# EAGLE design jnode (EAGLE 6.0)
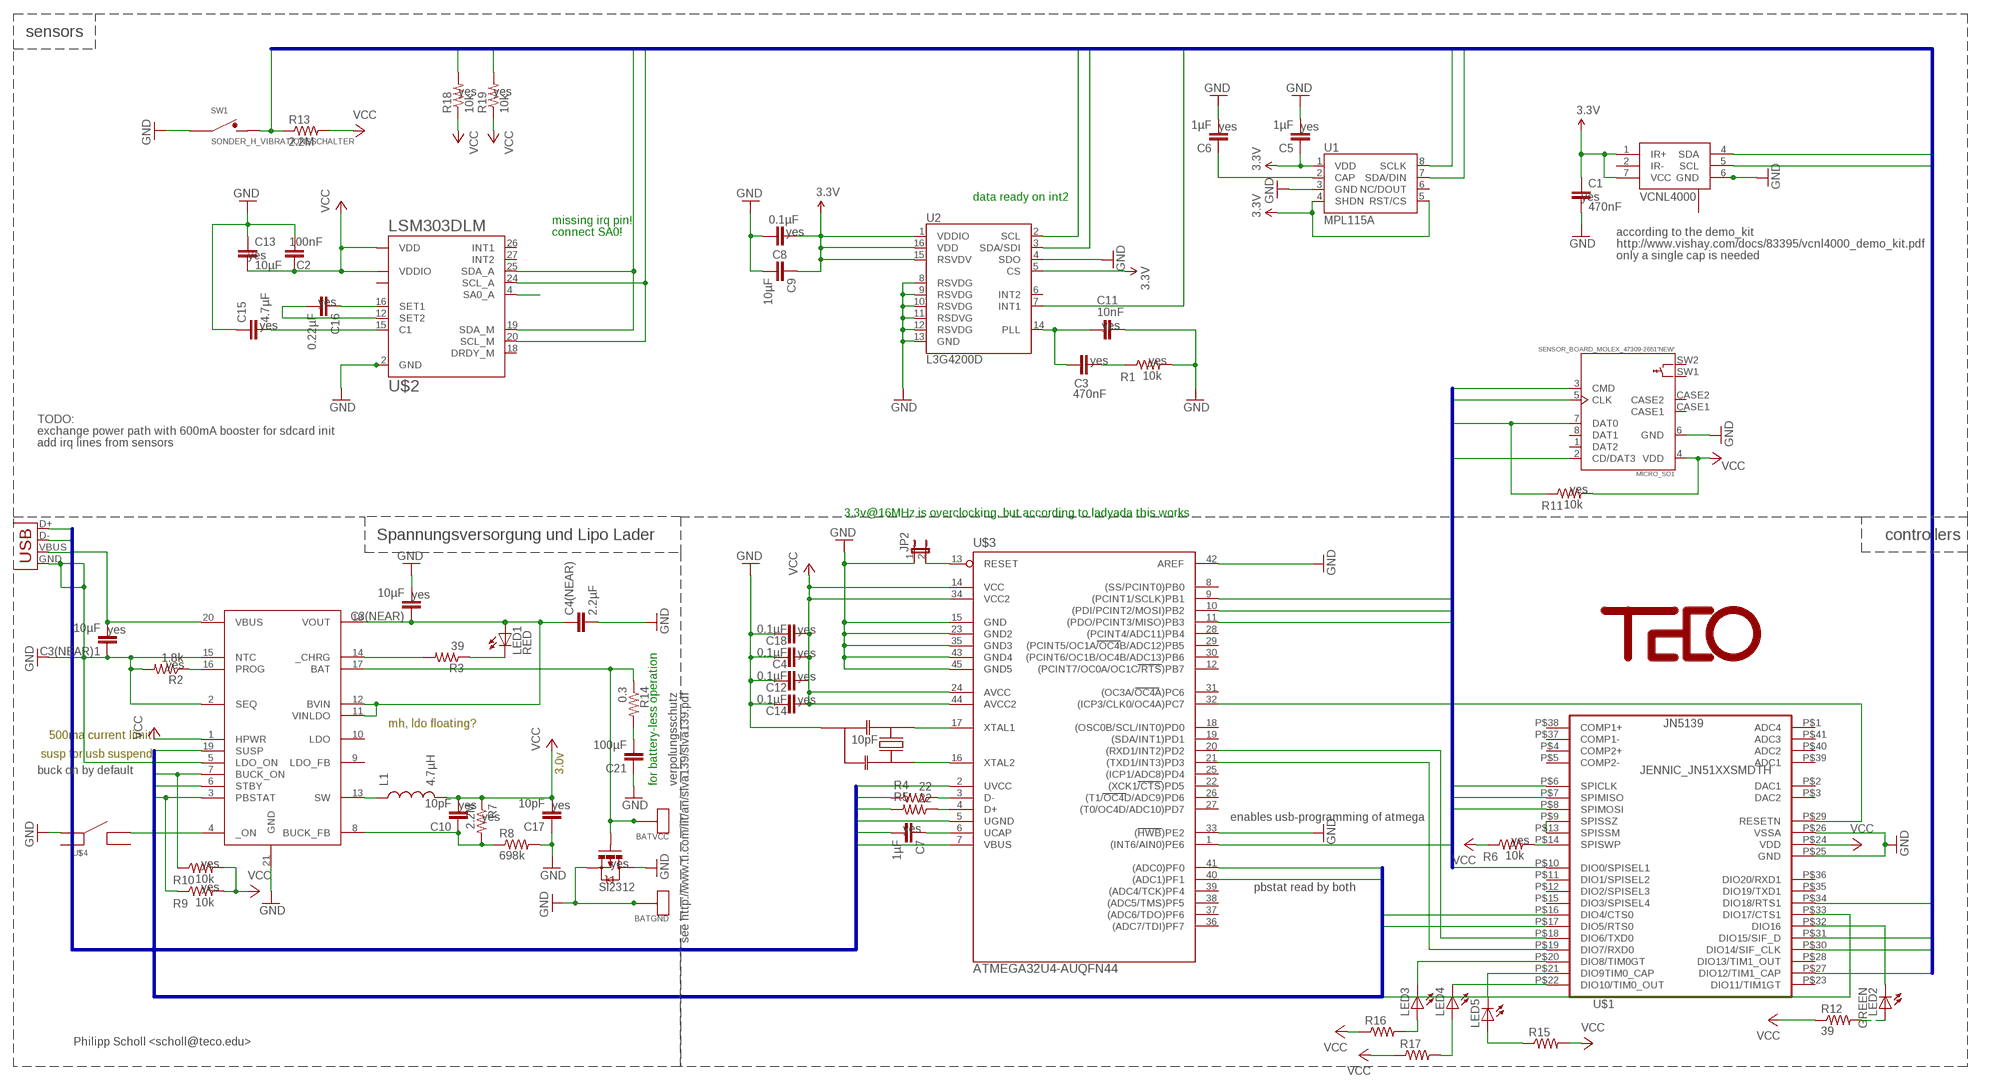
[diagram p0: schematic, sheet 1]

## Parts
BATGND  BATPAD  BATPADBATPAD  [BATPAD]
BATVCC  BATPAD  BATPADBATPAD  [BATPAD]
C1  470nF  CAP0402-CAP  [0402-CAP]
C2  100nF  CAP0402-CAP  [0402-CAP]
C3  470nF  CAP0402-CAP  [0402-CAP]
C3(NEAR)  10µF  CAP0603-CAP  [0603-CAP]
C3(NEAR)1  10µF  CAP0603-CAP  [0603-CAP]
C4  0.1µF  CAP0402-CAP  [0402-CAP]
C4(NEAR)  2.2µF  CAP0402-CAP  [0402-CAP]
C5  1µF  CAP0402-CAP  [0402-CAP]
C6  1µF  CAP0402-CAP  [0402-CAP]
C7  1µF  CAP0402-CAP  [0402-CAP]
C8  0.1µF  CAP0402-CAP  [0402-CAP]
C9  10µF  CAP0603-CAP  [0603-CAP]
C10  10pF  CAP0402-CAP  [0402-CAP]
C11  10nF  CAP0402-CAP  [0402-CAP]
C12  0.1µF  CAP0402-CAP  [0402-CAP]
C13  10µF  CAP0603-CAP  [0603-CAP]
C14  0.1µF  CAP0402-CAP  [0402-CAP]
C15  4.7µF  CAP0402-CAP  [0402-CAP]
C16  0.22µF  CAP0402-CAP  [0402-CAP]
C17  10pF  CAP0402-CAP  [0402-CAP]
C18  0.1µF  CAP0402-CAP  [0402-CAP]
C21  100µF  CAP0402-CAP  [0402-CAP]
JP2  JUMPER-2SMD-NO  [SJ_2S-NO]
L1  4.7µH  SPARKFUN_INDUCTOR  [MLP2012]
LED1  RED  LEDCHIP-LED0402  [CHIP-LED0402]
LED2  GREEN  LEDCHIP-LED0402  [CHIP-LED0402]
LED3  LEDGL100MD1MP1  [GL100MD1MP1]
LED4  LEDGL100MD1MP1  [GL100MD1MP1]
LED5  LEDGL100MD1MP1  [GL100MD1MP1]
MICRO_SD1  SENSOR_BOARD_MOLEX_47309-2651'NEW'  [SENSOR_BOARD_MOLEX_47309-2651]
R1  10k  RESISTOR0402-RES  [0402-RES]
R2  1.8k  RESISTOR0402-RES  [0402-RES]
R3  39  RESISTOR0402-RES  [0402-RES]
R4  22  RESISTOR0402-RES  [0402-RES]
R5  22  RESISTOR0402-RES  [0402-RES]
R6  10k  RESISTOR0402-RES  [0402-RES]
R7  2.2M  RESISTOR0402-RES  [0402-RES]
R8  698k  RESISTOR0402-RES  [0402-RES]
R9  10k  RESISTOR0402-RES  [0402-RES]
R10  10k  RESISTOR0402-RES  [0402-RES]
R11  10k  RESISTOR0402-RES  [0402-RES]
R12  39  RESISTOR0402-RES  [0402-RES]
R13  2.2M  RESISTOR0805-RES  [0805]
R14  0.3  RESISTOR0402-RES  [0402-RES]
R15  RESISTOR0402-RES  [0402-RES]
R16  RESISTOR0402-RES  [0402-RES]
R17  RESISTOR0402-RES  [0402-RES]
R18  10k  RESISTOR0402-RES  [0402-RES]
R19  10k  RESISTOR0402-RES  [0402-RES]
SI2312  MOSFET-PCHANNELSMD  [SOT23-3]
SW1  SONDER_H_VIBRATIONSSCHALTER  [SONDER_H_VIBSCHALTER]
U1  MPL115A  [LGA8]
U2  L3G4200D  [LGA16-4X4]
U$1  JENNIC_JN51XXSMDTH  [JN5148_SMDTH]
U$2  LSM303DLM  LSM303LGA28_LONG  [LGA28]
U$3  ATMEGA32U4-AUQFN44  [QFN44]
U$4  TACTILE_SWITCH  [EVQ-PUK02K]
U$5  LTC3553  [QFN20]
U$6  RESONATORPRQC-S  [PRQC]
U$9  TECO-LOGO  [TECO-LOGO]
VCNL4000  VCNL4000  [VNCL4000]
X1  USB-MICROB  [USB-MICROB]

## Nets
BUCK_ON: R10.1 U$1.P$16(DIO4/CTS0) U$5.7(BUCK_ON)
CLK: MICRO_SD1.5(CLK) U$1.P$6(SPICLK) U$3.9((PCINT1/SCLK)PB1)
D+: R5.2 X1.D+
D-: R4.2 X1.D-
GND: BATGND.1 BATGND.2(PIN) C1.2 C2.2 C3(NEAR)1.1 C3(NEAR).2 C4(NEAR).2 C4.1 C5.2 C6.2 C7.2 C8.1 C9.2 C11.1 C12.1 C13.1 C14.1 C15.1 C17.1 C18.1 C21.1 JP2.1 MICRO_SD1.6(GND) R1.2 R2.2 R8.2 SI2312.2(S) SI2312.3(D) SW1.1 U1.3(GND) U2.4(SDO) U2.8(RSVDG) U2.9(RSVDG) U2.10(RSVDG) U2.11(RSDVG) U2.12(RSVDG) U2.13(GND) U$1.P$25(GND) U$1.P$26(VSSA) U$2.1(GND) U$2.2(GND) U$2.8(GND) U$2.10(GND) U$2.28(GND) U$3.5(UGND) U$3.15(GND) U$3.23(GND2) U$3.33((HWB)PE2) U$3.35(GND3) U$3.42(AREF) U$3.43(GND4) U$3.45(GND5) U$4.1(A) U$5.2(SEQ) U$5.5(LDO_ON) U$5.15(NTC) U$5.21(GND) U$6.GND VCNL4000.6(GND) VCNL4000.12(GND) X1.GND
INT1: U2.7(INT1) U$1.P$34(DIO18/RTS1)
LEDRED: LED2.P$2(C) U$1.P$32(DIO16)
MISO: MICRO_SD1.7(DAT0) R11.1 U$1.P$7(SPIMISO) U$3.11((PDO/PCINT3/MISO)PB3)
MOSI: MICRO_SD1.3(CMD) U$1.P$8(SPIMOSI) U$3.10((PDI/PCINT2/MOSI)PB2)
N$1: R4.1 U$3.3(D-)
N$2: C16.1 U$2.16(SET1)
N$3: R5.1 U$3.4(D+)
N$4: C7.1 U$3.6(UCAP)
N$5: R2.1 U$5.16(PROG)
N$6: VCNL4000.2(IR-) VCNL4000.3(IR-)
N$8: C16.2 U$2.12(SET2)
N$9: U$4.4(B) U$5.4(_ON)
N$10: C6.1 U1.2(CAP)
N$11: LED1.P$2(C) R3.1
N$12: R3.2 U$5.14(_CHRG)
N$13: U$1.P$9(SPISSZ) U$1.P$13(SPISSM)
N$14: R6.2 U$1.P$14(SPISWP)
N$15: C3(NEAR).1 C4(NEAR).1 LED1.P$1(A) U$5.11(VINLDO) U$5.12(BVIN) U$5.18(VOUT)
N$16: U$3.17(XTAL1) U$6.2
N$17: U$3.16(XTAL2) U$6.1
N$18: L1.P$1 U$5.13(SW)
N$20: C10.1 R7.2 R8.1 U$5.8(BUCK_FB)
N$21: C21.2 R14.2
N$22: U$1.P$18(DIO6/TXD0) U$3.20((RXD1/INT2)PD2)
N$23: U$1.P$19(DIO7/RXD0) U$3.21((TXD1/INT3)PD3)
N$24: U$1.P$29(RESETN) U$3.32((ICP3/CLK0/OC4A)PC7)
N$25: C15.2 U$2.15(C1)
N$26: C3.1 C11.2 U2.14(PLL)
N$27: C3.2 R1.1
N$28: U$2.4(SA0_A)
N$29: LED2.P$1(A) R12.2
N$30: LED5.2(C) U$1.P$21(DIO9TIM0_CAP)
N$31: LED3.2(C) U$1.P$20(DIO8/TIM0GT)
N$32: LED3.1(A) R16.2
N$33: LED5.1(A) R15.1
N$34: LED4.2(C) U$1.P$22(DIO10/TIM0_OUT)
N$35: LED4.1(A) R17.2
PBSTAT: R9.1 U$1.P$33(DIO17/CTS1) U$3.40((ADC1)PF1) U$5.3(PBSTAT)
RES: JP2.2 U$3.13(RESET)
SCLK: R19.2 U1.8(SCLK) U2.2(SCL) U$1.P$30(DIO14/SIF_CLK) U$2.20(SCL_M) U$2.24(SCL_A) VCNL4000.5(SCL)
SDAT: R18.2 U1.7(SDA/DIN) U2.3(SDA/SDI) U$1.P$31(DIO15/SIF_D) U$2.19(SDA_M) U$2.25(SDA_A) VCNL4000.4(SDA)
SSEL: MICRO_SD1.2(CD/DAT3) U$1.P$10(DIO0/SPISEL1) U$3.1((INT6/AIN0)PE6)
STBY: U$1.P$17(DIO5/RTS0) U$5.6(STBY)
SUSP: U$3.41((ADC0)PF0) U$5.19(SUSP)
TCAP: R13.1 SW1.2 U$1.P$27(DIO12/TIM1_CAP)
VBATT: BATVCC.1 BATVCC.2(PIN) R14.1 SI2312.1(G) U$5.17(BAT)
VBUS: C3(NEAR)1.2 U$3.2(UVCC) U$3.7(VBUS) U$5.20(VBUS) X1.VBUS
VCC: C1.1 C2.1 C4.2 C5.1 C8.2 C9.1 C10.2 C12.2 C13.2 C14.2 C17.2 C18.2 L1.P$2 MICRO_SD1.4(VDD) R6.1 R7.1 R9.2 R10.2 R11.2 R12.1 R13.2 R15.2 R16.1 R17.1 R18.1 R19.1 U1.1(VDD) U1.4(SHDN) U1.5(RST/CS) U2.1(VDDIO) U2.5(CS) U2.15(RSVDV) U2.16(VDD) U$1.P$24(VDD) U$2.7(VDD) U$2.23(VDDIO) U$3.14(VCC) U$3.24(AVCC) U$3.34(VCC2) U$3.44(AVCC2) U$5.1(HPWR) VCNL4000.1(IR+) VCNL4000.7(VCC) ; supply symbol labelled 3.3V
Unconnected: MICRO_SD1.1(DAT2) MICRO_SD1.8(DAT1) MICRO_SD1.SW1 MICRO_SD1.SW2 U1.6(NC/DOUT) U2.6(INT2) U$1.P$1(ADC4) U$1.P$2(DAC1) U$1.P$3(DAC2) U$1.P$4(COMP2+) U$1.P$5(COMP2-) U$1.P$11(DIO1/SPISEL2) U$1.P$12(DIO2/SPISEL3) U$1.P$15(DIO3/SPISEL4) U$1.P$23(DIO11/TIM1GT) U$1.P$28(DIO13/TIM1_OUT) U$1.P$35(DIO19/TXD1) U$1.P$36(DIO20/RXD1) U$1.P$37(COMP1-) U$1.P$38(COMP1+) U$1.P$39(ADC1) U$1.P$40(ADC2) U$1.P$41(ADC3) U$2.5(RESV_VIO) U$2.18(DRDY_M) U$2.26(INT1) U$2.27(INT2) U$3.8((SS/PCINT0)PB0) U$3.12((PCINT7/OC0A/OC1C/RTS)PB7) U$3.18((OSC0B/SCL/INT0)PD0) U$3.19((SDA/INT1)PD1) U$3.22((XCK1/CTS)PD5) U$3.25((ICP1/ADC8)PD4) U$3.26((T1/OC4D/ADC9)PD6) U$3.27((T0/OC4D/ADC10)PD7) U$3.28((PCINT4/ADC11)PB4) U$3.29((PCINT5/OC1A/OC4B/ADC12)PB5) U$3.30((PCINT6/OC1B/OC4B/ADC13)PB6) U$3.31((OC3A/OC4A)PC6) U$3.36((ADC7/TDI)PF7) U$3.37((ADC6/TDO)PF6) U$3.38((ADC5/TMS)PF5) U$3.39((ADC4/TCK)PF4) U$4.2(B) U$4.3(A) U$5.9(LDO_FB) U$5.10(LDO) VCNL4000.8(NC) VCNL4000.9(NC) VCNL4000.10(NC) VCNL4000.11(NC)

## Buses
PWRCTRL:BUCK_ON,STBY,PBSTAT,SUSP
USB:D+,D-,VBUS,USBGND
SPI:SSEL,MISO,MOSI,CLK
I2C:SCLK,SDAT,TCAP,INT1

## Notes on the sheet
- sensors
- data ready on int2
- missing irq pin!
- connect SA0! | according to the demo_kit
- http://www.vishay.com/docs/83395/vcnl4000_demo_kit.pdf
- only a single cap is needed
- TODO:
- exchange power path with 600mA booster for sdcard init
- add irq lines from sensors
- 3.3v@16MHz is overclocking, but according to ladyada this works
- Spannungsversorgung und Lipo Lader | controllers
- verpolungsschutz | see http://www.ti.com/lit/an/slva139/slva139.pdf
- mh, ldo floating?
- 500ma current limit
- 10pF
- susp for usb suspend
- buck on by default | 3.0v
- for battery-less operation
- enables usb-programming of atmega
- pbstat read by both
- Philipp Scholl <scholl@teco.edu>

## Power pins joined to a net without a drawn wire
CASE1: MICRO_SD1.CASE1
CASE2: MICRO_SD1.CASE2

## Library data of the parts
BATGND BATVCC = jnode:BATPAD; DIGIKEY: http://search.digikey.com/scripts/DkSearch/dksus.dll?Detail&name=BK-82-ND; PLACE: no
C1 C3 = sparkfun:CAP: Capacitor Standard 0603 ceramic capacitor, and 0.1" leaded capacitor.; DIGIKEY: http://search.digikey.com/scripts/DkSearch/dksus.dll?Detail&name=311-1334-1-ND; TECO: yes
C2 C4(NEAR) = sparkfun:CAP: Capacitor Standard 0603 ceramic capacitor, and 0.1" leaded capacitor.; DIGIKEY: http://search.digikey.com/scripts/DkSearch/dksus.dll?Detail&name=445-7396-1-ND; TECO: yes
C3(NEAR) C3(NEAR)1 C9 = sparkfun:CAP: Capacitor Standard 0603 ceramic capacitor, and 0.1" leaded capacitor.; DIGIKEY: http://search.digikey.com/scripts/DkSearch/dksus.dll?Detail&name=445-7454-1-ND; TECO: yes
C4 C18 = sparkfun:CAP: Capacitor Standard 0603 ceramic capacitor, and 0.1" leaded capacitor.; DIGIKEY: http://search.digikey.com/scripts/DkSearch/dksus.dll?Detail&name=490-1318-1-ND; PLACE: no; TECO: yes
C5-C7 = sparkfun:CAP: Capacitor Standard 0603 ceramic capacitor, and 0.1" leaded capacitor.; DIGIKEY: http://search.digikey.com/scripts/DkSearch/dksus.dll?Detail&name=490-1320-1-ND; TECO: yes
C8 C12 C14 = sparkfun:CAP: Capacitor Standard 0603 ceramic capacitor, and 0.1" leaded capacitor.; DIGIKEY: http://search.digikey.com/scripts/DkSearch/dksus.dll?Detail&name=490-1318-1-ND; TECO: yes
C10 C17 = sparkfun:CAP: Capacitor Standard 0603 ceramic capacitor, and 0.1" leaded capacitor.; DIGIKEY: http://search.digikey.com/scripts/DkSearch/dksus.dll?Detail&name=311-1014-1-ND; TECO: yes
C11 = sparkfun:CAP: Capacitor Standard 0603 ceramic capacitor, and 0.1" leaded capacitor.; DIGIKEY: http://search.digikey.com/scripts/DkSearch/dksus.dll?Detail&name=478-1114-1-ND; TECO: yes
C13 = sparkfun:CAP: Capacitor Standard 0603 ceramic capacitor, and 0.1" leaded capacitor.; TECO: yes
C15 = sparkfun:CAP: Capacitor Standard 0603 ceramic capacitor, and 0.1" leaded capacitor.; DIGIKEY: http://search.digikey.com/scripts/DkSearch/dksus.dll?Detail&name=490-5408-1-ND; TECO: yes
C16 = sparkfun:CAP: Capacitor Standard 0603 ceramic capacitor, and 0.1" leaded capacitor.; DIGIKEY: http://search.digikey.com/scripts/DkSearch/dksus.dll?Detail&name=311-1350-1-ND; TECO: yes
C21 = sparkfun:CAP: Capacitor Standard 0603 ceramic capacitor, and 0.1" leaded capacitor.; COMMENT: should be 1210; DIGIKEY: http://search.digikey.com/scripts/DkSearch/dksus.dll?Detail&name=445-7396-1-ND; PLACE: no
JP2 = sparkfun:JUMPER-2: Jumper Basic 0.1" spaced jumper. Use with breakaway headers.
L1 = jnode:SPARKFUN_INDUCTOR: Inductors Basic Inductor/Choke - 0603 and 1206. Footprints are not proven and vary greatly between part numbers.; DIGIKEY: http://search.digikey.com/scripts/DkSearch/dksus.dll?Detail&name=445-6366-1-ND
LED1 LED2 = jnode:LED: LED OSRAM: - CHIPLED LG R971, LG N971, LY N971, LG Q971, LY Q971, LO R971, LY R971 LH N974, LH R974 LS Q976, LO Q976, LY Q976 LO Q996 - Hyper CHIPLED LW Q18S LB Q993, LB Q99A, LB R99A - SideLED LS A670, LO A670, LY A670, LG A670, LP A670 LB A673, LV A673, LT A673, LW A673 LH A674 LY A675 LS A676, LA A676, LO A676, LY A676, LW A676 LS A679, LY A679, LG A679 - Hyper Micro SIDELED® LS Y876, LA Y876, LO Y876, LY Y876 LT Y87S - SmartLED LW L88C, LW L88S LB L89C, LB L89S, LG L890 LS L89K, LO L89K, LY L89K LS L896, LA L896, LO L896, LY L896 - TOPLED LS T670, LO T670, LY T670, LG T670, LP T670 LSG T670, LSP T670, LSY T670, LOP T670, LYG T670 LG T671, LOG T671, LSG T671 LB T673, LV T673, LT T673, LW T673 LH T674 LS T676, LA T676, LO T676, LY T676, LB T676, LH T676, LSB T676, LW T676 LB T67C, LV T67C, LT T67C, LS T67K, LO T67K, LY T67K, LW E67C LS E67B, LA E67B, LO E67B, LY E67B, LB E67C, LV E67C, LT E67C LW T67C LS T679, LY T679, LG T679 LS T770, LO T770, LY T770, LG T770, LP T770 LB T773, LV T773, LT T773, LW T773 LH T774 LS E675, LA E675, LY E675, LS T675 LS T776, LA T776, LO T776, LY T776, LB T776 LHGB T686 LT T68C, LB T68C - Hyper Mini TOPLED® LB M676 - Mini TOPLED Santana® LG M470 LS M47K, LO M47K, LY M47K Source: http://www.osram.convergy.de LUXEON: - LUMILED® LXK2-PW12-R00, LXK2-PW12-S00, LXK2-PW14-U00, LXK2-PW14-V00 LXK2-PM12-R00, LXK2-PM12-S00, LXK2-PM14-U00 LXK2-PE12-Q00, LXK2-PE12-R00, LXK2-PE12-S00, LXK2-PE14-T00, LXK2-PE14-U00 LXK2-PB12-K00, LXK2-PB12-L00, LXK2-PB12-M00, LXK2-PB14-N00, LXK2-PB14-P00, LXK2-PB14-Q00 LXK2-PR12-L00, LXK2-PR12-M00, LXK2-PR14-Q00, LXK2-PR14-R00 LXK2-PD12-Q00, LXK2-PD12-R00, LXK2-PD12-S00 LXK2-PH12-R00, LXK2-PH12-S00 LXK2-PL12-P00, LXK2-PL12-Q00, LXK2-PL12-R00 Source: www.luxeon.com KINGBRIGHT: KA-3528ASYC Source: www.kingbright.com; DIGIKEY: http://search.digikey.com/scripts/DkSearch/dksus.dll?Detail&name=754-1128-1-ND; TECO: yes
LED3-LED5 = jnode:LED: LED OSRAM: - CHIPLED LG R971, LG N971, LY N971, LG Q971, LY Q971, LO R971, LY R971 LH N974, LH R974 LS Q976, LO Q976, LY Q976 LO Q996 - Hyper CHIPLED LW Q18S LB Q993, LB Q99A, LB R99A - SideLED LS A670, LO A670, LY A670, LG A670, LP A670 LB A673, LV A673, LT A673, LW A673 LH A674 LY A675 LS A676, LA A676, LO A676, LY A676, LW A676 LS A679, LY A679, LG A679 - Hyper Micro SIDELED® LS Y876, LA Y876, LO Y876, LY Y876 LT Y87S - SmartLED LW L88C, LW L88S LB L89C, LB L89S, LG L890 LS L89K, LO L89K, LY L89K LS L896, LA L896, LO L896, LY L896 - TOPLED LS T670, LO T670, LY T670, LG T670, LP T670 LSG T670, LSP T670, LSY T670, LOP T670, LYG T670 LG T671, LOG T671, LSG T671 LB T673, LV T673, LT T673, LW T673 LH T674 LS T676, LA T676, LO T676, LY T676, LB T676, LH T676, LSB T676, LW T676 LB T67C, LV T67C, LT T67C, LS T67K, LO T67K, LY T67K, LW E67C LS E67B, LA E67B, LO E67B, LY E67B, LB E67C, LV E67C, LT E67C LW T67C LS T679, LY T679, LG T679 LS T770, LO T770, LY T770, LG T770, LP T770 LB T773, LV T773, LT T773, LW T773 LH T774 LS E675, LA E675, LY E675, LS T675 LS T776, LA T776, LO T776, LY T776, LB T776 LHGB T686 LT T68C, LB T68C - Hyper Mini TOPLED® LB M676 - Mini TOPLED Santana® LG M470 LS M47K, LO M47K, LY M47K Source: http://www.osram.convergy.de LUXEON: - LUMILED® LXK2-PW12-R00, LXK2-PW12-S00, LXK2-PW14-U00, LXK2-PW14-V00 LXK2-PM12-R00, LXK2-PM12-S00, LXK2-PM14-U00 LXK2-PE12-Q00, LXK2-PE12-R00, LXK2-PE12-S00, LXK2-PE14-T00, LXK2-PE14-U00 LXK2-PB12-K00, LXK2-PB12-L00, LXK2-PB12-M00, LXK2-PB14-N00, LXK2-PB14-P00, LXK2-PB14-Q00 LXK2-PR12-L00, LXK2-PR12-M00, LXK2-PR14-Q00, LXK2-PR14-R00 LXK2-PD12-Q00, LXK2-PD12-R00, LXK2-PD12-S00 LXK2-PH12-R00, LXK2-PH12-S00 LXK2-PL12-P00, LXK2-PL12-Q00, LXK2-PL12-R00 Source: www.luxeon.com KINGBRIGHT: KA-3528ASYC Source: www.kingbright.com; FARNELL: http://de.farnell.com/sharp/gl100md1mp1/ir-emitter-smd-940nm/dp/9707816?Ntt=970-7816; PLACE: no
MICRO_SD1 = teco_div:SENSOR_BOARD_MOLEX_47309-2651; DIGIKEY: http://search.digikey.com/scripts/DkSearch/dksus.dll?Detail&name=WM3974CT-ND; TECO: yes
R1 R6 R9-R11 = sparkfun:RESISTOR: Resistor Basic schematic elements and footprints for 0603, 1206, and PTH resistors.; DIGIKEY: http://search.digikey.com/scripts/DkSearch/dksus.dll?Detail&name=311-10KJRCT-ND; TECO: yes
R2 = sparkfun:RESISTOR: Resistor Basic schematic elements and footprints for 0603, 1206, and PTH resistors.; DIGIKEY: http://search.digikey.com/scripts/DkSearch/dksus.dll?Detail&name=311-1.8KJRCT-ND; TECO: yes
R3 = sparkfun:RESISTOR: Resistor Basic schematic elements and footprints for 0603, 1206, and PTH resistors.; DIGIKEY: http://search.digikey.com/scripts/DkSearch/dksus.dll?Detail&name=311-39JRCT-ND
R4 R5 = sparkfun:RESISTOR: Resistor Basic schematic elements and footprints for 0603, 1206, and PTH resistors.; DIGIKEY: http://search.digikey.com/scripts/DkSearch/dksus.dll?Detail&name=311-22JRCT-ND
R7 = sparkfun:RESISTOR: Resistor Basic schematic elements and footprints for 0603, 1206, and PTH resistors.; DIGIKEY: http://search.digikey.com/scripts/DkSearch/dksus.dll?Detail&name=541-2.20MLCT-ND; TECO: yes
R8 = sparkfun:RESISTOR: Resistor Basic schematic elements and footprints for 0603, 1206, and PTH resistors.; DIGIKEY: http://search.digikey.com/scripts/DkSearch/dksus.dll?Detail&name=RMCF0402FT698KCT-ND
R12 = sparkfun:RESISTOR: Resistor Basic schematic elements and footprints for 0603, 1206, and PTH resistors.
R13 = sparkfun:RESISTOR: Resistor Basic schematic elements and footprints for 0603, 1206, and PTH resistors.; DIGIKEY: http://search.digikey.com/scripts/DkSearch/dksus.dll?Detail&name=541-2.20MLCT-ND
R14 = sparkfun:RESISTOR: Resistor Basic schematic elements and footprints for 0603, 1206, and PTH resistors.; DIGIKEY: http://search.digikey.com/scripts/DkSearch/dksus.dll?Detail&name=P.30AKCT-ND; PLACE: no
R15-R17 = sparkfun:RESISTOR: Resistor Basic schematic elements and footprints for 0603, 1206, and PTH resistors.; PLACE: no
R18 R19 = sparkfun:RESISTOR: Resistor Basic schematic elements and footprints for 0603, 1206, and PTH resistors.; DIGIKEY: http://search.digikey.com/scripts/DkSearch/dksus.dll?Detail&name=541-2.20MLCT-ND; PLACE: no; TECO: yes
SI2312 = sparkfun:MOSFET-PCHANNEL; DIGIKEY: http://search.digikey.com/scripts/DkSearch/dksus.dll?Detail&name=SI2312CDS-T1-GE3CT-ND; TECO: yes
SW1 = jnode:SONDER_H_VIBRATIONSSCHALTER: Vibrationsschalter von FZK oder Signalquest SignalQuest, Inc. 1 Mechanic St. Lebanon, NH 03766 USA www.signalquest.com
U1 = mpl115:MPL115A: MPL115A1 (SPI) and MPL115A2 (I2C) Miniature Digital Barometer 5.0x3.0x1.2mm LGA Package; DIGIKEY: http://search.digikey.com/scripts/DkSearch/dksus.dll?Detail&name=MPL115A2T1CT-ND; TECO: yes
U2 = sparkfun:L3G4200D: L3G4200D Three-axis, digital output gyroscope The L3G4200D is a low-power three-axis angular rate sensor, has a full scale of ±250/±500/±2000 dps and is capable of measuring rates with a user-selectable bandwidth. It includes a sensing element and an IC interface capable of providing the measured angular rate to the external world through a digital interface (I2C/SPI). Package: 4x4x1.1 LGA-16 (LGA16-4x4.PAC); DIGIKEY: http://search.digikey.com/scripts/DkSearch/dksus.dll?Detail&name=497-11071-1-ND; FARNELL: http://de.farnell.com/stmicroelectronics/l3g4200d/gyro-mems-3achsen-16llga-16lga/dp/1872924?Ntt=l3g4200; FUTUREELECTRIC: http://de.futureelectronics.com/de/technologies/semiconductors/analog/sensors/motion/Seiten/2007852-L3G4200DTR.aspx
U$1 = jnode:JENNIC_JN51XX: JN5139-xxx-M00xxx, Farnell: 1500175; FUTUREELECTRIC: http://de.futureelectronics.com/de/technologies/semiconductors/microcontrollers/32-bit/Seiten/6004977-JN5148-001M00T,534.aspx; TECO: yes
U$2 = jnode:LSM303: LSM303DLH ? 3-axis accelerometer and 3-axis magnetometer ? Digital supply voltage IOs: 1.8 V ? Power-down mode ? ±1.3 to ±8,1 gauss magnetic field full-scale ? ±2 g/±4 g/±8 g dynamically selectable fullscale ? 16-bit data out ? I2C serial interface http://www.st.com/stonline/products/literature/ds/16941/lsm303dlh.pdf; DIGIKEY: http://search.digikey.com/scripts/DkSearch/dksus.dll?Detail&name=497-11240-1-ND; FUTUREELECTRIC: http://de.futureelectronics.com/de/technologies/semiconductors/analog/sensors/accelerometers/Seiten/8010012-LSM303DLMTR.aspx
U$3 = jnode:ATMEGA32U4-AU; DIGIKEY: http://search.digikey.com/scripts/DkSearch/dksus.dll?Detail&name=ATMEGA32U4-MU-ND
U$4 = jnode:TACTILE_SWITCH: collection of tactile switches; DIGIKEY: http://search.digikey.com/scripts/DkSearch/dksus.dll?Detail&name=P10852SCT-ND
U$5 = jnode:LTC3553; DIGIKEY: http://search.digikey.com/scripts/DkSearch/dksus.dll?Detail&name=LTC3553EUD%23PBF-ND
U$6 = jnode:RESONATOR: Ceramic Resonator with caps AWSCR-16.00CV-T: 16Mhz ceramic resonator with 22pF capacitors PRQC16.00SR5010X000: 16Mhz ceramic resonator with 10pF capacitors; DIGIKEY: http://search.digikey.com/scripts/DkSearch/dksus.dll?Detail&name=478-5420-1-ND
U$9 = teco_div:TECO-LOGO
VCNL4000 = VCNL4000:VCNL4000; DIGIKEY: http://search.digikey.com/scripts/DkSearch/dksus.dll?Detail&name=751-1505-1-ND; TECO: yes
X1 = sparkfun:USB: USB Connectors USB-B-PTH is fully proven SKU : PRT-00139 USB-miniB is fully proven SKU : PRT-00587 USB-A-PCB is untested. USB-A-H is throughly reviewed, but untested. Spark Fun Electronics SKU : PRT-00437 USB-B-SMT is throughly reviewed, but untested. Needs silkscreen touching up. USB-A-S has not been used/tested USB-MB-H has not been used/tested; DIGIKEY: http://search.digikey.com/scripts/DkSearch/dksus.dll?Detail&name=H11635CT-ND

## Board
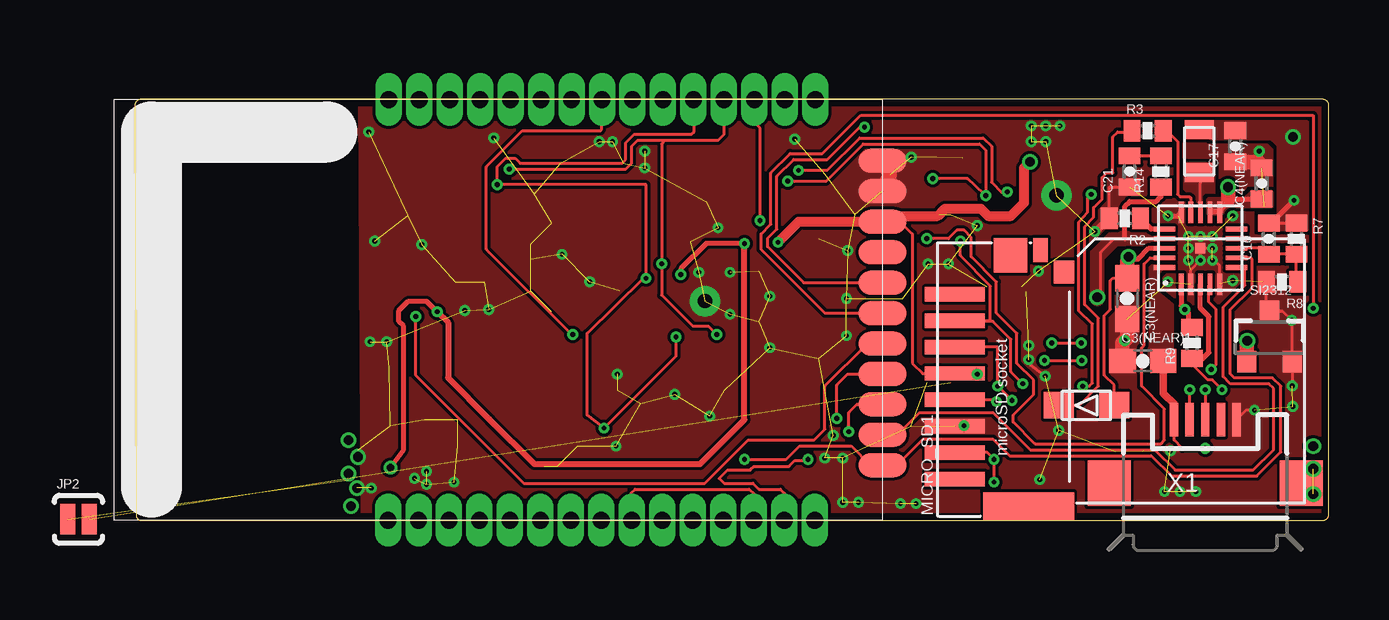
[diagram p1: board, top side]
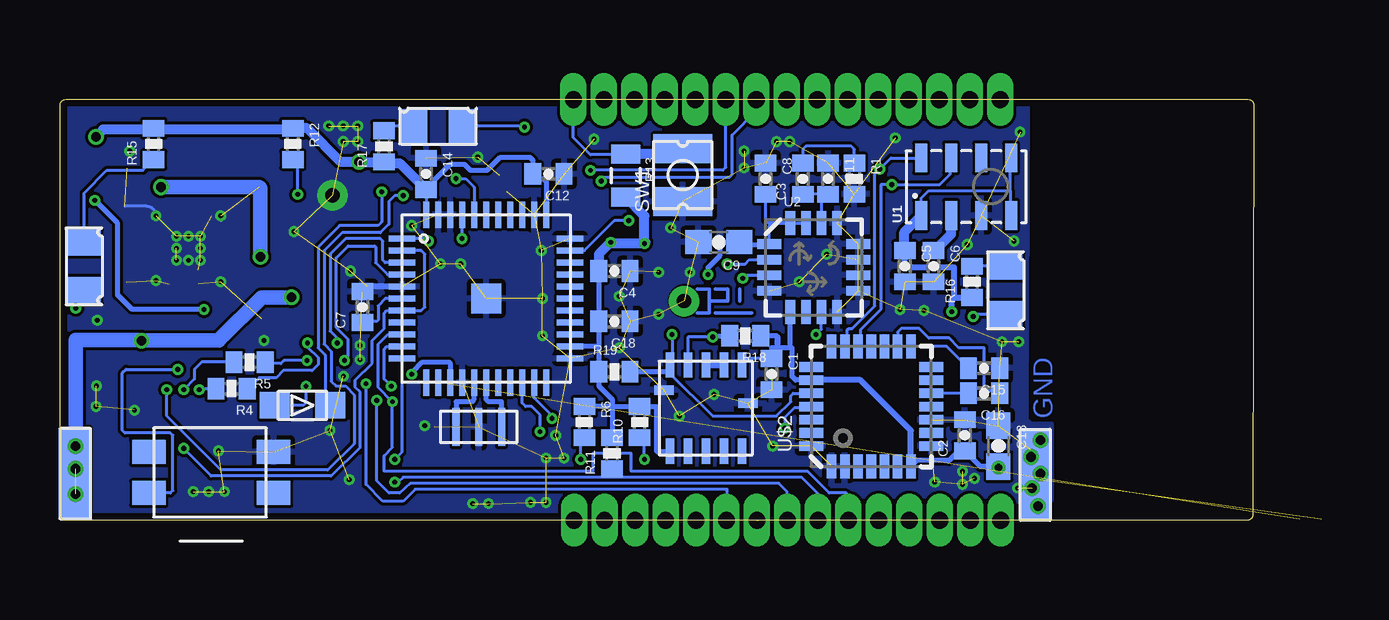
[diagram p2: board, bottom side, seen from below]

Size 49.75 x 17.56 mm. Coordinates in mm from the lower left corner, seen from the top.
Outline: 0.25,17.56 arc88 0,17.31 0.05,0.25 arc92 0.3,0 49.5,0 arc90 49.75,0.25 49.75,17.31 arc90 49.5,17.56 0.25,17.56
Copper layers (1*16): Top 0.035mm / dielectric 1.5mm / Bottom 0.035mm
Design rules: minimum track width 0.125mm, minimum drill 0.2mm, track to track 0.125mm, track to pad 0.125mm, pad to pad 0.125mm, via to via 0.125mm, smd to smd 0.125mm, copper to edge 0.3mm, drill to drill 0.2mm, minimum pad ring 0.2mm, minimum via ring 0.125mm, stop-mask expansion 0.075mm, vias tented up to drill 10mil, thermal gap 0.2mm

### Footprints (pad centres in the part's own frame; a part is rotated, then mirrored left to right if it is on the bottom)
BATPAD = smd 1.2 x 3.8: 1 0.6,1.9; 2 0.6,1.9
0402-CAP = smd 0.7 x 0.9: 1 -0.65,0; 2 0.65,0
0603-CAP = smd 1.1 x 1: 1 -0.85,0; 2 0.85,0
SJ_2S-NO = smd 0.635 x 1.27: 1 -0.45,0; 2 0.45,0
MLP2012 = smd 0.8 x 1.2: P$1 0.9,0; P$2 -0.9,0
CHIP-LED0402 = smd 1.25 x 1.1: P$1 -0.15,0; P$2 2.15,0
GL100MD1MP1 = smd 1.1 x 1.4: 1 -1,0; 2 1,0
SENSOR_BOARD_MOLEX_47309-2651 = smd 0.6 x 2.5: 1 3.43,2.385; 2 2.33,2.385; 3 1.23,2.385; 4 0.13,2.385; 5 -0.97,2.385; 6 -2.07,2.385; 7 -3.17,2.385; 8 -4.27,2.385 | smd 1.2 x 3.79: CASE1 -5.42,-0.695 | smd 1.45 x 1.4: CASE2 5.055,0.06 | smd 1 x 0.6: SW1 5.28,-1.19 | smd 0.95 x 0.85: SW2 4.355,-2.165
0402-RES = smd 0.7 x 0.9: 1 -0.65,0; 2 0.65,0
0805 = smd 0.8 x 1.2: 1 -0.9,0; 2 0.9,0
SOT23-3 = smd 0.8 x 0.9: 1 -0.95,-1; 2 0.95,-1; 3 0,1.1
SONDER_H_VIBSCHALTER = smd 1.2 x 2.45: 1 -1.1,0; 2 1.1,0
LGA8 = smd 1.2 x 0.5: 1 -1.2,1.875; 2 -1.2,0.625; 3 -1.2,-0.625; 4 -1.2,-1.875; 5 1.2,-1.875; 6 1.2,-0.625; 7 1.2,0.625; 8 1.2,1.875
LGA16-4X4 = smd 1 x 0.4: 1 -1.85,0.975; 2 -1.85,0.325; 3 -1.85,-0.325; 4 -1.85,-0.975; 9 1.85,-0.975; 10 1.85,-0.325; 11 1.85,0.325; 12 1.85,0.975 | smd 0.4 x 1: 5 -0.975,-1.85; 6 -0.325,-1.85; 7 0.325,-1.85; 8 0.975,-1.85; 13 0.975,1.85; 14 0.325,1.85; 15 -0.325,1.85; 16 -0.975,1.85
JN5148_SMDTH = drill 0.7 pad 1.016 long: P$1 -2.29,20.6; P$2 -2.29,19.33; P$3 -2.29,18.06; P$4 -2.29,16.79; P$5 -2.29,15.52; P$6 -2.29,14.25; P$7 -2.29,12.98; P$8 -2.29,11.71; P$9 -2.29,10.44; P$10 -2.29,9.17; P$11 -2.29,7.9; P$12 -2.29,6.63; P$13 -2.29,5.36; P$14 -2.29,4.09; P$15 -2.29,2.82; P$27 15.254,2.794; P$28 15.254,4.064; P$29 15.254,5.334; P$30 15.254,6.604; P$31 15.254,7.874; P$32 15.254,9.144; P$33 15.254,10.414; P$34 15.254,11.684; P$35 15.254,12.954; P$36 15.254,14.224; P$37 15.254,15.494; P$38 15.254,16.764; P$39 15.254,18.034; P$40 15.254,19.304; P$41 15.254,20.574 | smd 1 x 2: P$16 0,0; P$17 1.27,0; P$18 2.54,0; P$19 3.81,0; P$20 5.08,0; P$21 6.35,0; P$22 7.62,0; P$23 8.89,0; P$24 10.16,0; P$25 11.43,0; P$26 12.7,0
LGA28 = smd 1 x 0.4: 1 -2.5,1.65; 2 -2.5,1.1; 3 -2.5,0.55; 4 -2.5,0; 5 -2.5,-0.55; 6 -2.5,-1.1; 7 -2.5,-1.65; 15 2.5,-1.65; 16 2.5,-1.1; 17 2.5,-0.55; 18 2.5,0; 19 2.5,0.55; 20 2.5,1.1; 21 2.5,1.65 | smd 0.4 x 1: 8 -1.65,-2.5; 9 -1.1,-2.5; 10 -0.55,-2.5; 11 0,-2.5; 12 0.55,-2.5; 13 1.1,-2.5; 14 1.65,-2.5; 22 1.65,2.5; 23 1.1,2.5; 24 0.55,2.5; 25 0,2.5; 26 -0.55,2.5; 27 -1.1,2.5; 28 -1.65,2.5
QFN44 = smd 1.1 x 0.25: 1 -3.5,2.5; 2 -3.5,2; 3 -3.5,1.5; 4 -3.5,1; 5 -3.5,0.5; 6 -3.5,0; 7 -3.5,-0.5; 8 -3.5,-1; 9 -3.5,-1.5; 10 -3.5,-2; 11 -3.5,-2.5; 23 3.5,-2.5; 24 3.5,-2; 25 3.5,-1.5; 26 3.5,-1; 27 3.5,-0.5; 28 3.5,0; 29 3.5,0.5; 30 3.5,1; 31 3.5,1.5; 32 3.5,2; 33 3.5,2.5 | smd 0.25 x 1.1: 12 -2.5,-3.5; 13 -2,-3.5; 14 -1.5,-3.5; 15 -1,-3.5; 16 -0.5,-3.5; 17 0,-3.5; 18 0.5,-3.5; 19 1,-3.5; 20 1.5,-3.5; 21 2,-3.5; 22 2.5,-3.5; 34 2.5,3.5; 35 2,3.5; 36 1.5,3.5; 37 1,3.5; 38 0.5,3.5; 39 0,3.5; 40 -0.5,3.5; 41 -1,3.5; 42 -1.5,3.5; 43 -2,3.5; 44 -2.5,3.5 | smd 1.25 x 1.25: 45 0,0
EVQ-PUK02K = smd 1.4 x 1: 1 5,2.5; 2 5,0.8; 3 -0.2,2.5; 4 -0.2,0.8
QFN20 = smd 0.9 x 0.2: 1 -1.5,0.8; 2 -1.5,0.4; 3 -1.5,0; 4 -1.5,-0.4; 5 -1.5,-0.8; 11 1.5,-0.8; 12 1.5,-0.4; 13 1.5,0; 14 1.5,0.4; 15 1.5,0.8 | smd 0.2 x 0.9: 6 -0.8,-1.5; 7 -0.4,-1.5; 8 0,-1.5; 9 0.4,-1.5; 10 0.8,-1.5; 16 0.8,1.5; 17 0.4,1.5; 18 0,1.5; 19 -0.4,1.5; 20 -0.8,1.5 | smd 0.42 x 0.42: 21 0,0
PRQC = smd 0.3 x 1.6: 1 -0.95,0; 2 0.95,0; GND 0,0
VNCL4000 = smd 0.35 x 1.05: 1 -1.5,-1.8; 2 -0.75,-1.8; 3 0,-1.8; 4 0.75,-1.8; 5 1.5,-1.8; 7 1.5,1.8; 8 0.75,1.8; 9 0,1.8; 10 -0.75,1.8; 11 -1.5,1.8 | smd 0.805 x 0.4: 6 1.75,-0.75; 12 -1.75,-0.2
USB-MICROB = smd 0.35 x 1.4: D+ 0,2.65; D- -0.65,2.65; GND 1.3,2.65; ID 0.65,2.65; VBUS -1.3,2.65 | smd 1.8 x 1.9: MT1 -4,0; MT2 4,0

### Placement (x,y rotation side)
BATGND  8.5,3.8 180 bottom
BATVCC  48.5,3.85 180 bottom
C1  20.1,6.1 270 bottom
C2  12.05,3.55 90 bottom
C3  18.8,14.25 90 bottom
C3(NEAR)  41.35,9.25 270 top
C3(NEAR)1  42,6.65 0 top
C4  26.65,10.4 180 bottom
C4(NEAR)  46.95,14.05 90 top
C5  14.55,10.6 270 bottom
C6  13.35,10.6 270 bottom
C7  37.15,8.9 90 bottom
C8  20.35,14.25 270 bottom
C9  22.3,11.6 180 bottom
C10  47.25,11.75 90 top
C11  17.75,14.25 270 bottom
C12  29.4,14.45 180 bottom
C13  10.65,3.1 270 bottom
C14  34.5,14.45 270 bottom
C15  11.25,6.35 180 bottom
C16  11.25,5.3 180 bottom
C17  45.85,15.6 90 top
C18  26.65,8.3 180 bottom
C21  41.45,14.55 90 top
JP2  -2.35,0.05 0 top
L1  44.35,15.4 270 top
LED1  40.65,4.8 180 top
LED2  40.65,4.8 0 bottom
LED3  10.35,9.6 270 bottom
LED4  34,16.45 0 bottom
LED5  48.75,10.6 270 bottom
MICRO_SD1  36.55,6 90 top
R1  16.65,14.25 270 bottom
R2  41.25,12.6 180 top
R3  42.2,16.25 0 top
R4  42.6,5.5 180 bottom
R5  41.85,6.6 180 bottom
R6  27.9,4.1 270 bottom
R7  48.4,11.75 270 top
R8  47.8,9.95 180 top
R9  44.05,7.4 90 top
R10  25.6,4.1 90 bottom
R11  26.75,2.8 90 bottom
R12  40.05,15.7 270 bottom
R13  26.18,14.38 270 bottom
R14  42.75,14.55 90 top
R15  45.85,15.7 90 bottom
R16  11.75,9.95 90 bottom
R17  36.25,15.6 90 bottom
R18  21.2,7.7 180 bottom
R19  26.65,6.2 0 bottom
SI2312  47.28,7.62 0 top
SW1  23.8,14.4 90 bottom
U1  11.99,13.92 90 bottom
U2  18.35,10.55 0 bottom
U$1  31.15,2.3 90 top
U$2  15.95,4.75 90 bottom
U$3  32,9.25 0 bottom
U$4  45.85,0.35 0 bottom
U$5  44.4,11.35 90 top
U$6  32.3,3.9 0 bottom
U$9  22.95,9.15 180 bottom
VCNL4000  22.84,4.69 180 bottom
X1  44.6,1.55 0 top

### Tracks (layer width: path | path; a pad name or v marks a point on that pad's centre or on a via)
BUCK_ON  (via drill 0.2)
  Top 0.125: U$5.7 46.5,10.95 46.55,10.9 46.55,9.7 45.65,8.8 45.65,6.1 45.8,5.95 47.4,5.95 47.75,5.6 47.75,2.85 46.75,1.85 43.2,1.85 42.35,2.7 36.45,2.7 35.75,3.4 32.85,3.4 31.75,2.3 U$1.P$16 | v25.4,2.55 27.15,2.55 27.7,3.1 29.85,3.1 30.65,2.3 U$1.P$16 | U$1.P$16 30.85,2.6
  Bottom 0.125: R10.1 25.4,3.25 v25.4,2.55
CLK  (via drill 0.2)
  Top 0.125: 34.19,5 MICRO_SD1.5 35.82,5.03 v35.9,4.95
  Bottom 0.125: U$1.P$6 16.95,0.06 16.95,1.1 17,1.15 17.7,1.15 18.6,2.05 25.95,2.05 25.95,2.8 27.55,2.8 27.55,2.05 36.25,2.05 36.25,2.7 35.9,3.05 v35.9,4.95 36.5,5.55 36.5,7.35 36.1,7.75 U$3.9
D+  (via drill 0.2)
  Top 0.125: v44.6,5.45 X1.D+
  Bottom 0.125: v44.6,5.45 44.15,5.9 44.15,6.3 43.85,6.6 R5.2
D-  (via drill 0.2)
  Top 0.125: X1.D- v43.95,5.45
  Bottom 0.125: v43.95,5.45 43.9,5.5 R4.2
GND  (via drill 0.2, 0.4, 0.6 pad 1.27)  (120 unrouted)
  Top 0.125: v44.9,11.35 U$5.21 v44.4,10.85 44,10.45 U$5.2 | C21.1 40.6,13.9 R2.2 | 47,9.95 R8.2 47.15,8.85 SI2312.3 47.83,8.72 v48.2,8.35 48.23,8.32 SI2312.2 | U$5.5 45.2,10.65 v44.9,10.85 | X1.GND 46.3,4.6 v46.65,4.6 | SI2312.2 48.3,6.7 | SI2312.2 48.23,5.92 v48.23,5.61 | v34.55,3.95 34.53,3.93 MICRO_SD1.6 | v37.94,6.02 37.25,6.55 v37.25,6.7
  Top 0.2: U$5.15 43.45,12.7 v43.05,12.7
  Top 0.305: v46.85,15.4 46.85,14.8 C4(NEAR).2 | v40,12.05 arc45 40.08,12.09 R2.2
  Top 0.61: C17.1 46.7,14.95 arc-90 C4(NEAR).2 | C3(NEAR).2 41.35,7.6 v41.25,7.5 41.15,7.4 C3(NEAR)1.1 | U$1.P$26 31.45,14.4 U$1.P$25
  Bottom 0: v9.25,1.35 9.3,1.7 BATGND.2 | v8.9,3.35 9.3,2.95 v9.3,2.65 8.9,2.25 v8.9,1.95 8.9,1.7 v9.25,1.35 | v9,0.6 9,1 v9.25,1.35
  Bottom 0.125: v45.75,12.7 arc-90 46.15,13.1 47.05,13.1 | 36.95,9.75 C7.2 | 43.05,12.5 v43.05,12.7
  Bottom 0.25: U$3.5 36.95,9.75
  other vias: 44.9,11.85 43.9,10.85 43.05,9.95 45.75,10 44.4,11.85 43.9,11.85 43.9,11.35 37.25,7.3 38.5,3.75 37.35,15.8 37.95,15.8 37.35,16.45 37.95,16.45 38.55,16.45 37.7,1.7 42.9,1.2 43.55,1.2 44.2,1.2 48.25,4.75 37.65,10.4 31.9,0.7 32.55,0.7 29.5,0.75 30.15,0.75 28.75,2.6 29.5,2.6 29.7,11.25 29.65,9.25 29.65,7.7 33.05,10.7 27.5,15.9 24.3,12.2 21.25,15.4 24.8,10.35 22.5,5.25 23.95,4.35 20.05,3.1 13.3,1.6 9.8,7.45 10.5,7.45 13.75,8.75 14.75,8.8 17.8,11.1 18.95,9.95 9.85,1.35 24.8,8.6 20.1,6.1 23.5,10.35 19.9,15.8 21.25,14.7 29.1,3.55 43.15,2.9 32.35,15.15 19.35,15.8 14.95,15.95 12.15,1.5 12.15,2.05 11.65,1.75 38.4,13.55 23.75,9.15 10,11.65 11.95,11.5 33.9,10.7 35.1,12.3 9.75,16.2 26.45,7.2 26.45,9.35
  pour Bottom (rank 2): 9.5,0 49.5,0 arc90 49.75,0.25 49.75,17.35 arc90 49.5,17.6 9.4,17.6
  pour Top (rank 3, no thermals): 9.45,0 49.43,0 arc90 49.75,0.32 49.75,17.28 arc90 49.43,17.6 9.35,17.5
  pour Bottom (no thermals): 8.55,0.9 9.85,0.9 9.85,1 9.85,4 8.55,4
INT1  (via drill 0.2)
  Top 0.125: v18.25,7.75 18.2,7.75 14.65,11.3 14.65,14.75 16.15,16.25 19.4,16.25 19.45,16.3 19.45,17.54 U$1.P$34
  Bottom 0.125: U2.7 18.02,7.97 v18.25,7.75
LEDRED  (via drill 0.2)
  Top 0.125: v27.65,14.6 28.85,14.6 30.2,15.95 35.35,15.95 35.7,15.6 35.7,14.1 36.1,13.7 v36.35,13.7
  Bottom 0.125: v36.35,13.7 36.35,12.45 36.5,12.3 38.1,12.3 39,11.4 39,7.2 38.7,6.9 38.7,5 arc-90 LED2.P$2 | U$1.P$32 22.01,14.72 22.13,14.6 v27.65,14.6
MISO  (via drill 0.2)
  Top 0.125: v35.8,1.6 v35.8,2.55 35.52,2.83 MICRO_SD1.7
  Bottom 0.125: v35.8,1.6 35.65,1.6 35.45,1.8 26.75,1.8 | 26.75,1.8 18.85,1.8 18.15,1.1 18.15,0.03 U$1.P$7 | 26.75,1.8 R11.1 | U$3.11 35.5,2.85 v35.8,2.55
MOSI  (via drill 0.2)
  Top 0.125: v36.55,5 v35.95,5.6 35.95,7.23 MICRO_SD1.3
  Bottom 0.125: U$1.P$8 19.45,1.2 19.8,1.55 35.15,1.55 35.6,1.15 36.05,1.15 36.55,1.65 v36.55,5 | U$3.10 36.15,7.25 36.25,7.15 36.25,5.9 v35.95,5.6
N$1  (via drill 0.2)
  Top 0.125: v38.2,7.4 v39.44,7.4
  Bottom 0.125: v38.2,7.4 38.2,7.6 38.5,7.9 38.5,11.1 37.85,11.75 36.4,11.75 36.3,11.65 36.3,10.85 36.2,10.75 U$3.3 | v39.44,7.4 39.44,7.24 39,6.8 39,6.5 39.25,6.25 40.45,6.25 40.75,5.95 41.45,5.95 R4.1
N$2
  Bottom 0.125: C16.1 10.7,5.4 11.2,5.4 11.25,5.45 11.25,7.2 12.3,7.2 12.7,7.6 13.55,7.6 13.95,8 14.7,8 14.85,7.85 U$2.16
N$3  (via drill 0.2)
  Top 0.125: v37.9,6.67 v39.46,6.67
  Bottom 0.125: R5.1 41.2,6.35 | U$3.4 36.1,10.25 36.6,10.75 36.6,11.4 36.65,11.45 37.75,11.45 38.25,10.95 38.25,8.05 37.75,7.55 37.75,6.82 v37.9,6.67 | R5.1 41.1,6.5 | v39.46,6.67 40.42,6.67 40.55,6.54 41.14,6.54 R5.1
N$4
  Bottom 0.125: U$3.6 36.2,9.25 36.5,8.95 36.5,8.35 36.55,8.3 37.1,8.3 C7.1
N$5
  Top 0.2: U$5.16 42.35,12.15 R2.1
N$6
  Bottom 0.254: VCNL4000.3 VCNL4000.2
N$8
  Bottom 0.125: C16.2 U$2.12
N$9  (via drill 0.2)
  Top 0.125: U$5.4 44.75,9.8 44.75,9.1 45.05,8.8 45.05,6.5 v44.85,6.3
  Bottom 0.125: U$4.4 45.15,1.15 45.05,1.25 45.05,3.55 45.15,3.65 47.05,3.65 47.15,3.75 47.15,6.15 47,6.3 v44.85,6.3
N$10
  Bottom 0.125: 13.31,11.23 C6.1
  Bottom 0.406: 13.31,11.23 12.61,11.94 U1.2
N$11
  Top 0.125: R3.1 41.5,16.2 40.95,16.2 40.75,16 40.75,14.5 40.5,14.5 40.3,14.3 40.3,13.4 39.95,13.05 39.95,12.65 39.58,12.25 39.58,9 40.15,8.44 40.15,5.6 39.35,4.8 LED1.P$2
N$12
  Top 0.125: U$5.14 44,13.45 43.95,13.5 43.55,13.5 43.45,13.6 43.45,15.8 43,16.25 R3.2
N$13  (1 unrouted)
  Top 0.125: 20.65,0.01 20.65,1.1 20.85,1.3 25.6,1.3 25.8,1.1 U$1.P$13
N$14  (via drill 0.2)
  Top 0.125: U$1.P$14 27.06,1.14 26.9,1.3 26,1.3 25.75,1.55 24.55,1.55 24.35,1.75 24.7,2.1 25.65,2.1 25.8,2.25 27.25,2.25 27.5,2.5 28,2.5 v28.05,2.55
  Bottom 0.125: v28.05,2.55 28.05,3.45 R6.2
N$15  (via drill 0.4)
  Top 0.125: 45.25,12.9 U$5.11 | C3(NEAR).1 40.75,10.1 40.65,10 40.65,8.8 40.4,8.55 40.4,6.05 40.8,5.65 LED1.P$1
  Top 0.2: C4(NEAR).1 45.55,13.4 45.25,12.9 44.85,12.9 U$5.12 U$5.11 | U$5.18 42.25,11.35 41.8,10.9 41.45,10.9 | 41.35,10.8 41.45,10.9 | 41.45,10.9 41.4,10.95 v41.4,11
  Top 0.61: C3(NEAR).1 41.35,10.8 | v45.55,13.9 45.55,13.4
  Bottom 0.61: v45.55,13.9 41.45,13.9 41.4,13.85 v41.4,11
  pour Top (no thermals): 44.75,12.8 44.75,13.4 46.25,13.4 46.55,13.7 47.35,13.7 47.35,13.1 45.55,13.1 45.25,12.8
N$16
  Bottom 0.2: U$3.17 32,5.05 31.9,4.95 31.35,4.95 U$6.2
N$17
  Bottom 0.2: U$3.16 32.5,5.05 32.6,4.95 33.25,4.95 U$6.1
N$18
  Top 0.125: U$5.13 44.4,14.05
  pour Top (rank 2, no thermals): 44.45,13.1 43.75,13.8 43.75,14.9 44.95,14.9 44.95,13.6
N$20
  Top 0.125: R8.1 48.4,9.95 R7.2 C10.1 47.25,11.35 U$5.8
N$21
  Top 0.125: R14.2 C21.2
N$22  (via drill 0.2)
  Top 0.125: U$1.P$18 30.09,4.84 29.75,4.5 v29.75,3.7
  Bottom 0.125: U$3.20 30.5,4.9 30.35,4.75 30.1,4.75 29.75,4.4 v29.75,3.7
N$23  (via drill 0.2)
  Top 0.125: U$1.P$19 29.7,6.1 29.25,5.65 v29.25,4.25
  Bottom 0.125: 30,6.1 U$3.21 30,5.1 29.25,4.35 v29.25,4.25
N$24  (via drill 0.2)
  Top 0.125: 25.85,17.52 U$1.P$29 25.82,16.58 26.05,16.35 v26.05,12.5
  Bottom 0.125: U$3.32 27.9,11.25 26.65,12.5 v26.05,12.5
N$25
  Bottom 0.125: C15.2 12.8,7.25 U$2.15
N$26
  Bottom 0.125: U2.14 18.02,13.6 C11.2 C3.1
N$27
  Bottom 0.125: R1.1 16.65,15.47 16.77,15.6 18.67,15.6 18.8,15.47 C3.2
N$29  (via drill 0.2)
  Top 0.125: v39.85,13.6 39.7,13.45 39.7,12.85 39.33,12.44 39.33,8.74 39.9,8.2 39.9,5.72 39.77,5.6 v39.5,5.6
  Bottom 0.125: v39.85,13.6 39.85,14.9 R12.2 | v39.5,5.6 39.5,4.92 39.62,4.8 LED2.P$1
N$30  (via drill 0.2)
  Top 0.125: v49.1,8.85 49.1,16.9 30.25,16.9 28.65,15.3 27.3,15.3 26.5,14.5 26.5,12.35 26.1,11.95 26.1,11.3 28.75,8.65 U$1.P$21
  Bottom 0.125: LED5.2 49.15,9.2 49.15,8.9 v49.1,8.85
N$31  (via drill 0.2)
  Top 0.125: U$1.P$20 30.53,7.38 28.75,5.6 28.75,3.8 28.3,3.35 25.55,3.35 23.75,1.55 16.2,1.55 11.7,6.05 v11.7,8.5
  Bottom 0.125: v11.7,8.5 11.6,8.6 LED3.2
N$32
  Bottom 0.125: LED3.1 R16.2
N$33
  Bottom 0.125: LED5.1 48.75,13.65 47.8,14.6 46.3,14.6 R15.1
N$34  (via drill 0.2)
  Top 0.125: U$1.P$22 27.87,9.92 26.37,11.42 26.37,11.77 26.75,12.15 26.75,14.35 27.45,15.05 28.85,15.05 30.2,16.4 v30.4,16.4
  Bottom 0.125: 32.8,16.25 LED4.2 30.45,16.45 v30.4,16.4
N$35
  Bottom 0.125: R17.2 36.05,16.45 LED4.1
PBSTAT  (via drill 0.2)
  Top 0.125: 44.5,6.75 R9.1 44.05,6.5 44.7,5.87 44.9,5.87 v45.3,5.45 | 35.38,13.61 v35.45,13.55 | 35.38,13.61 34.7,14.25 v33.25,14.25 | 35.38,13.61 35.45,13.68 35.45,15.45 35.2,15.7 30.35,15.7 28.8,14.15 v27.2,14.15
  Top 0.2: 44.5,6.75 44.75,7 44.75,8.5 44.4,8.85 U$5.3
  Bottom 0.125: v45.3,5.45 45.3,4.35 43.05,2.1 38.6,2.1 37.5,3.2 37.5,5.24 37.85,5.6 38.25,5.6 38.45,5.8 38.45,7.05 38.75,7.35 38.75,11.25 38,12 36.4,12 36.05,12.35 36.05,13.3 35.8,13.55 v35.45,13.55 | v33.25,14.25 32.85,14.25 32.5,13.9 U$3.40 | 20.74,17.11 U$1.P$33 20.74,17.09 21.75,16.07 21.75,14.43 21.87,14.3 27.07,14.3 27.2,14.18 v27.2,14.15
RES  (1 unrouted)
SCLK  (via drill 0.2)
  Top 0.125: U$1.P$30 24.55,16.1 24.3,15.85 22.1,15.85 | 22.1,15.85 21.95,15.7 v21.95,10.7 21.95,9.4 23.25,8.1 23.9,8.1 v24.25,7.75 | 22.1,15.85 20.95,15.85 20.7,15.6 20.7,14.9 20.45,14.65 v15.6,14.65
  Bottom 0.125: U$2.20 16.95,7.35 16.95,7.95 16.9,8 16.75,8 15.8,8.95 15.8,14.45 v15.6,14.65 15.13,15.12 U1.8 | U$2.24 19.2,5.3 19.3,5.2 19.3,4.95 19.9,4.35 22.55,4.35 24.34,6.14 VCNL4000.5 24.25,6.58 v24.25,7.75 | U2.2 21.02,10.88 21.2,10.7 v21.95,10.7
  Bottom 0.2: R19.2 24.34,6.2 VCNL4000.5
SDAT  (via drill 0.2)
  Top 0.125: U$1.P$31 23.3,17.53 23.3,16.2 23.2,16.1 20.8,16.1 20.45,15.75 20.45,15.05 20.3,14.9 16.05,14.9 15.85,15.1 15.45,15.1 15.1,14.75 v15.1,14 21.3,14 v21.3,10.1 21.2,10.1 18.85,7.8 18.85,4.4 v19.55,3.85 22.55,6.85 v22.55,7.65
  Bottom 0.125: U$2.19 16.4,7.35 16.4,7.95 15.55,8.8 15.55,14 v15.1,14 13.1,14 12.65,14.45 12.65,15.09 U1.7 | U2.3 21.17,10.22 v21.3,10.1 | v19.55,3.85 19.55,4.3 19.15,4.7 18.5,4.7 U$2.25 | v22.55,7.65 23.59,7.65 VCNL4000.4
  Bottom 0.2: v22.55,7.65 22.5,7.7 R18.2
SSEL  (via drill 0.2)
  Top 0.125: v37,5.7 36.5,6.2 36.5,7.55 35.75,8.3 34.16,8.3 MICRO_SD1.2 35.65,8.33 35.65,9.77 34.4,11.05 v34.4,11.65
  Bottom 0.125: v37,5.7 37,1.5 36.3,0.8 35.45,0.8 34.95,1.3 21.95,1.3 21.95,0.04 U$1.P$10 | v34.4,11.65 34.45,11.75 U$3.1
STBY
  Top 0.125: U$5.6 46.2,10.55 46.25,10.5 46.25,9.8 45.35,8.9 45.35,6 45.65,5.7 47.25,5.7 47.45,5.5 47.45,2.95 46.6,2.1 43.35,2.1 42.5,2.95 37.3,2.95 35.75,4.5 32.7,4.5 31.77,3.57 U$1.P$17
SUSP  (via drill 0.2)
  Top 0.125: U$5.19 42.3,10.95 42.05,10.7 42.05,7.3 41.95,7.2 41.95,5.6 42.9,4.65 42.9,3.35 42.75,3.2 37.5,3.2 36.6,4.1 36.6,4.4 37.45,5.25 37.45,5.85 36.75,6.55 36.75,7.8 35.9,8.65 35.9,9.95 34.85,11 34.85,11.8 34.55,12.1 34.25,12.1 33.9,11.75 v33,11.75
  Bottom 0.125: v33,11.75 U$3.41
TCAP
  Bottom 0.125: U$1.P$27 28.36,15.96 27.65,15.25 26.21,15.25 R13.1
  Bottom 0.406: SW1.2 24.02,15.28 R13.1
VBATT  (via drill 0.4)  (2 unrouted)
  Top 0.125: 40.25,9.2 40.25,11.2 40.8,11.75 41.25,11.75 U$5.17
  Top 0.2: R14.1 42.75,13.5 42.55,13.3 41.45,13.3 41.25,13.1 41.25,11.75
  Top 0.61: SI2312.1 46.33,7.5 v46.35,7.5
  Bottom 0.61: v40.1,9.3 41.35,9.3 43.13,7.52 43.13,7.5 v46.35,7.5 46.35,7.52 49.1,7.52 v49.1,3.1 BATVCC.2
  other vias: 49.1,2.15 49.1,1.1
  pour Top (no thermals): 42.55,11.8 42.35,11.8 42.15,12 40.65,12 39.85,11.2 39.85,9.25 arc90 40.1,9 arc90 40.35,9.25 40.35,10.9 40.95,11.5 42.15,11.5 42.35,11.7 42.65,11.7
VBUS  (via drill 0.2)
  Top 0.125: X1.VBUS 43.3,3.35 43.65,3 v44.6,3
  Top 0.305: X1.VBUS 43.3,4.85 42.85,5.3 C3(NEAR)1.2
  Bottom 0.125: U$3.2 34.7,11.25 34.55,11.1 34.55,8.9 34.7,8.75 U$3.7 36.15,8.75 36.25,8.65 36.25,8 36.75,7.5 36.75,6.55 37.45,5.85 37.45,5.55 37.25,5.35 37.25,3.05 38.45,1.85 43.45,1.85 v44.6,3
  pour Top (no thermals): 42.75,10.6 42.35,10.6 42.25,10.5 42.25,6.8 43.25,6.8 43.25,9 42.65,9.5 42.65,10.3 42.85,10.5
VCC  (via drill 0.2, 0.3, 0.4)
  Top 0.125: C10.2 R7.1 | 43.9,8.2 R9.2 | v35.1,6.1 35.05,6.13 MICRO_SD1.4 32.82,6.13 32.4,6.55 32.4,11.95 31.65,12.7
  Top 0.2: C10.2 47.35,12.4 v48.3,13.35 | U$5.1 43.6,8.95 v43.75,8.8 43.9,8.65 43.9,8.2 | U$1.P$24 31.02,12.46 30.95,12.46 30.95,12.7 | U$1.P$24 31.15,12.2 | U$1.P$24 31.11,12.5 | v25.4,11.55 23.8,11.55 22.75,10.5 v22.75,10.25 | v12.6,8.7 12.15,9.15 11.4,9.15 11,8.75 11,8.3 11.2,8.1 11.2,2.95 v10.65,2.2
  Top 0.25: v25.4,11.55 25.4,4.2 23.55,2.35 16.65,2.35 14.77,4.22 13.05,5.95 13.05,8.25 v12.6,8.7
  Top 0.406: 30.89,12.7 30.95,12.7 31.65,12.7 33.45,12.7 33.75,13 35.25,13 35.55,12.7 36.5,12.7 37.05,13.25 37.05,14.7 v37.3,14.95 | 31.02,12.46 27.66,12.46 v26.8,11.6
  Bottom 0.125: C4.2 27,10.75 | R17.1 36.2,14.9 | C5.1 14.56,11.27 | 19.25,7.2 19.32,7.2 | VCNL4000.1 21.34,6.75 C1.1 | C2.1 12.3,2.9 | U1.1 13.86,13.44 13.55,13.75 10.15,13.75 | 10.15,13.75 10.15,15.09 U1.5 | 10.15,13.75 10.15,12.76 U1.4 | U2.16 U2.15 | U2.16 20.07,12.4 20.2,12.28 U2.1 20.2,11.5 | C8.2 20.35,12.53 20.22,12.4 U2.16 | C14.2 U$3.44 | 29.92,14.25 30.05,14.38 C12.2
  Bottom 0.2: v48.3,13.35 47.35,12.4 47.35,9.4 46.75,8.8 v43.75,8.8 | R12.1 40,16.3 R15.2 | 26.75,4.75 R11.2 | 26.75,4.75 R6.1 | 26.75,4.75 R10.2 24.9,4.75 24.9,2.89 VCNL4000.7 | 26.75,4.75 26.75,5.05 27.3,5.6 R19.1 27.3,7.25 | v35.1,6.1 35.05,6.2 34.65,6.6 33.55,6.6 33.5,6.55 U$3.14 | U$2.23 19.1,5.85 19.25,6 19.25,7.2 | U2.5 19.32,7.2 20.1,7.2 C1.1 19.85,6.75 | 19.85,7.65 19.9,7.7 R18.1 | 12.3,2.9 12.7,2.5 14.05,2.5 U$2.7 | C2.1 11.4,2.25 C13.2 v10.65,2.2 | 20.2,11.5 21.35,11.5 arc90 C9.1 22.15,11.6 22.25,11.5 22.25,11.05 22.75,10.55 v22.75,10.25 | 34.5,13.85 33.5,14.85 32.9,14.85 32.65,14.6 31.95,14.6 31.4,15.15 30.17,15.15 30.05,15.03 C12.2 | U$3.34 29.5,14.12 29.62,14.25 29.92,14.25 | 27.3,7.25 C18.2 C4.2 | 27.3,7.25 U$3.24
  Bottom 0.25: 12.5,9.3 R16.1 | 12.5,9.3 12.5,10.55 14.55,10.55 C5.1 | U$2.7 14.3,3.75 16.4,5.85 U$2.23 | 19.85,6.75 19.85,7.65 | v12.6,8.7 12.6,9.2 12.5,9.3
  Bottom 0.406: 40,16.3 47.95,16.3 v48.25,16 | C4.2 27.3,11.1 v26.8,11.6 26.75,11.55 v25.4,11.55 | v25.4,11.55 25.4,12.7 R13.2 | 14.56,11.27 14.56,12.02 U1.1 | v25.4,11.55 25.35,11.6 | R17.1 v37.3,14.95 38.05,14.95 39.45,16.35 R12.1 | 36.2,14.9 35.6,14.9 C14.2 34.5,13.85
  pour Top (no thermals): 44.85,16.65 48.85,16.65 48.85,12.1 46.85,12.1 46.85,12.7 47.65,12.7 47.65,15.6 47.35,15.9 44.85,15.9

### Text on the board
Bottom: GND